# Altium schematic sheet PLC.SchDoc
size A4; SheetNumber: 1; SheetTotal: 1
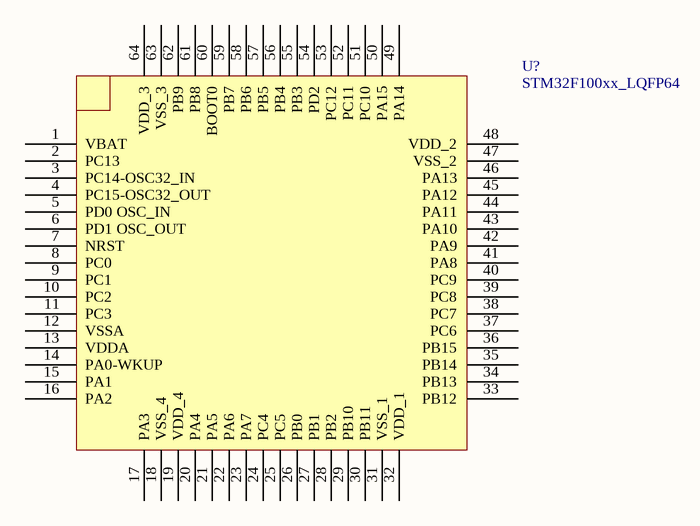
[diagram p0: PLC.SchDoc]

## Parts
U?  STM32F100xx_LQFP64  [STM32_LQFP64]

## Nets

Not connected (* = marked no-connect by the designer): U? 1(VBAT) 2(PC13) 3(PC14-OSC32_IN) 4(PC15-OSC32_OUT) 5(PD0_OSC_IN) 6(PD1_OSC_OUT) 7(NRST) 8(PC0) 9(PC1) 10(PC2) 11(PC3) 12(VSSA) 13(VDDA) 14(PA0-WKUP) 15(PA1) 16(PA2) 17(PA3) 18(VSS_4) 19(VDD_4) 20(PA4) 21(PA5) 22(PA6) 23(PA7) 24(PC4) 25(PC5) 26(PB0) 27(PB1) 28(PB2) 29(PB10) 30(PB11) 31(VSS_1) 32(VDD_1) 33(PB12) 34(PB13) 35(PB14) 36(PB15) 37(PC6) 38(PC7) 39(PC8) 40(PC9) 41(PA8) 42(PA9) 43(PA10) 44(PA11) 45(PA12) 46(PA13) 47(VSS_2) 48(VDD_2) 49(PA14) 50(PA15) 51(PC10) 52(PC11) 53(PC12) 54(PD2) 55(PB3) 56(PB4) 57(PB5) 58(PB6) 59(PB7) 60(BOOT0) 61(PB8) 62(PB9) 63(VSS_3) 64(VDD_3)